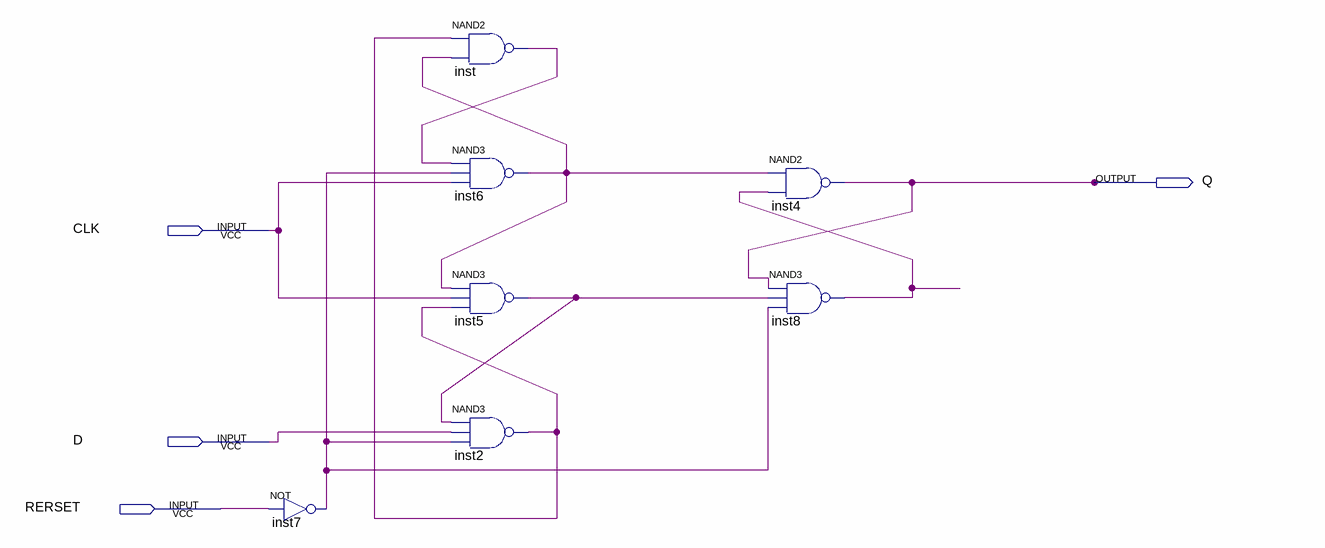
[diagram p0: schematic sheet]
// Quartus schematic DFF_OK.bdf as structural Verilog: 7 symbols, 4 pins
module DFF_OK (
  input  CLK,
  input  D,
  input  RERSET,
  output Q
);

  wire inst2_out, inst5_out, inst6_out, inst7_out, inst8_out, inst_out;

  not inst7 (inst7_out, RERSET);
  nand inst (inst_out, inst2_out, inst6_out);
  nand inst6 (inst6_out, inst_out, inst7_out, CLK);
  nand inst5 (inst5_out, inst6_out, CLK, inst2_out);
  nand inst2 (inst2_out, inst5_out, D, inst7_out);
  nand inst4 (Q, inst6_out, inst8_out);
  nand inst8 (inst8_out, Q, inst5_out, inst7_out);
endmodule
